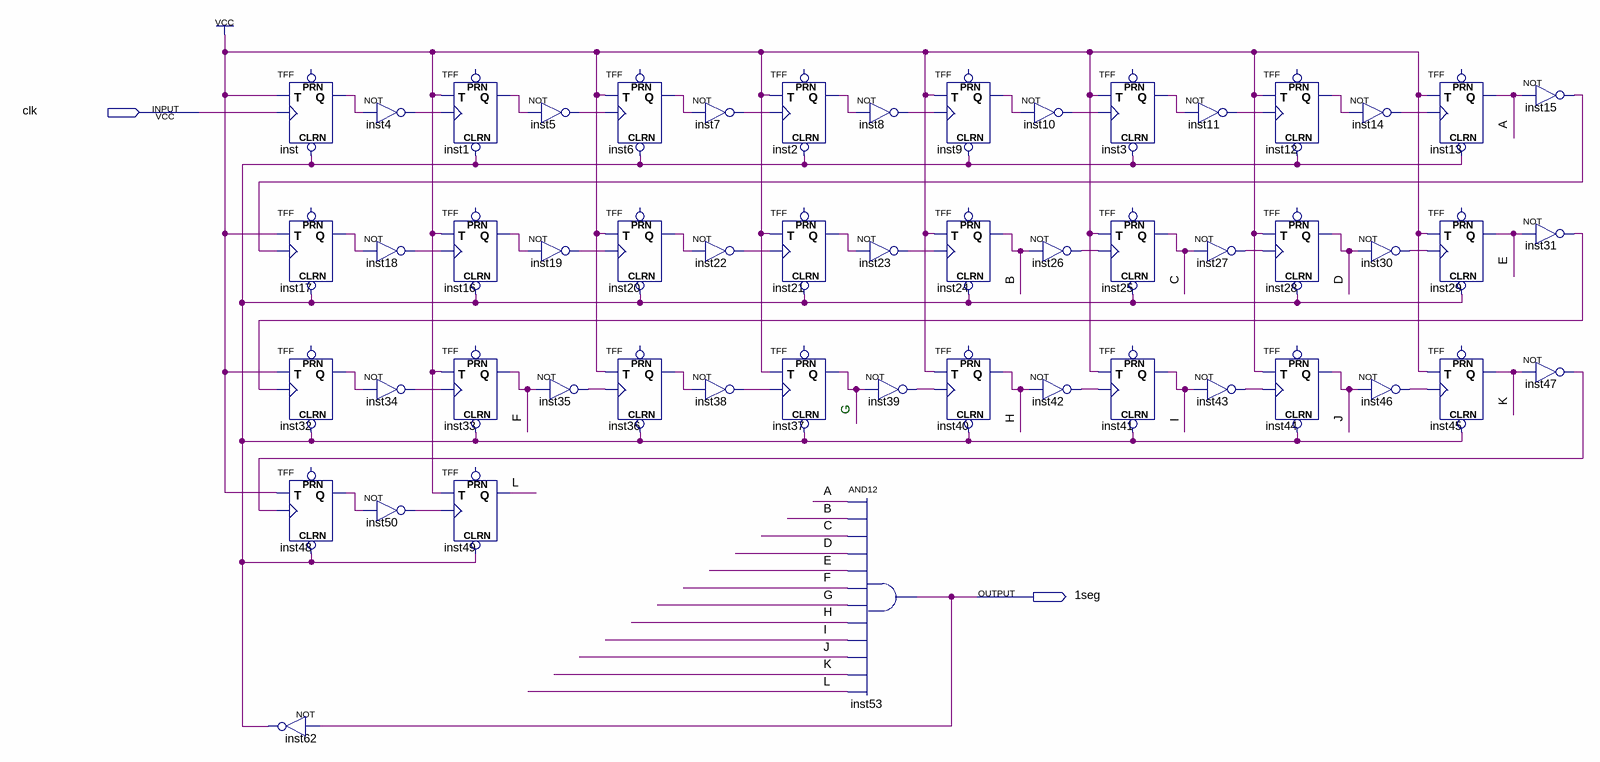
[diagram p0: schematic sheet]
// Quartus schematic Temporizador.bdf as structural Verilog: 53 symbols, 2 pins
module Temporizador (
  input  clk,
  output \1seg 
);

  wire A, B, C, D, E, F, G, H, I, inst1_q, inst2_q, inst3_q, inst4_out, inst5_out, inst6_q, inst7_out,
       inst8_out, inst9_q, inst10_out, inst11_out, inst12_q, inst14_out, inst15_out, inst16_q, inst17_q,
       inst18_out, inst19_out, inst20_q, inst21_q, inst22_out, inst23_out, inst26_out, inst27_out,
       inst30_out, inst31_out, inst32_q, inst34_out, inst35_out, inst36_q, inst38_out, inst39_out,
       inst42_out, inst43_out, inst46_out, inst47_out, inst48_q, inst50_out, inst62_out, inst_q, J, K, L;

  TFF inst (.CLRN(inst62_out), .T(1'b1), .CLK(clk), .Q(inst_q));  // open: PRN
  TFF inst17 (.CLRN(inst62_out), .T(1'b1), .CLK(inst15_out), .Q(inst17_q));  // open: PRN
  TFF inst32 (.CLRN(inst62_out), .T(1'b1), .CLK(inst31_out), .Q(inst32_q));  // open: PRN
  TFF inst48 (.CLRN(inst62_out), .T(1'b1), .CLK(inst47_out), .Q(inst48_q));  // open: PRN
  not inst62 (inst62_out, \1seg );
  not inst4 (inst4_out, inst_q);
  not inst18 (inst18_out, inst17_q);
  not inst34 (inst34_out, inst32_q);
  not inst50 (inst50_out, inst48_q);
  TFF inst1 (.CLRN(inst62_out), .T(1'b1), .CLK(inst4_out), .Q(inst1_q));  // open: PRN
  TFF inst16 (.CLRN(inst62_out), .T(1'b1), .CLK(inst18_out), .Q(inst16_q));  // open: PRN
  TFF inst33 (.CLRN(inst62_out), .T(1'b1), .CLK(inst34_out), .Q(F));  // open: PRN
  TFF inst49 (.CLRN(inst62_out), .T(1'b1), .CLK(inst50_out), .Q(L));  // open: PRN
  not inst5 (inst5_out, inst1_q);
  not inst19 (inst19_out, inst16_q);
  not inst35 (inst35_out, F);
  TFF inst6 (.CLRN(inst62_out), .T(1'b1), .CLK(inst5_out), .Q(inst6_q));  // open: PRN
  TFF inst20 (.CLRN(inst62_out), .T(1'b1), .CLK(inst19_out), .Q(inst20_q));  // open: PRN
  TFF inst36 (.CLRN(inst62_out), .T(1'b1), .CLK(inst35_out), .Q(inst36_q));  // open: PRN
  not inst7 (inst7_out, inst6_q);
  not inst22 (inst22_out, inst20_q);
  not inst38 (inst38_out, inst36_q);
  TFF inst2 (.CLRN(inst62_out), .T(1'b1), .CLK(inst7_out), .Q(inst2_q));  // open: PRN
  TFF inst21 (.CLRN(inst62_out), .T(1'b1), .CLK(inst22_out), .Q(inst21_q));  // open: PRN
  TFF inst37 (.CLRN(inst62_out), .T(1'b1), .CLK(inst38_out), .Q(G));  // open: PRN
  not inst8 (inst8_out, inst2_q);
  not inst23 (inst23_out, inst21_q);
  not inst39 (inst39_out, G);
  and inst53 (\1seg , A, B, C, D, E, F, G, H, I, J, K, L);
  TFF inst9 (.CLRN(inst62_out), .T(1'b1), .CLK(inst8_out), .Q(inst9_q));  // open: PRN
  TFF inst24 (.CLRN(inst62_out), .T(1'b1), .CLK(inst23_out), .Q(B));  // open: PRN
  TFF inst40 (.CLRN(inst62_out), .T(1'b1), .CLK(inst39_out), .Q(H));  // open: PRN
  not inst10 (inst10_out, inst9_q);
  not inst26 (inst26_out, B);
  not inst42 (inst42_out, H);
  TFF inst3 (.CLRN(inst62_out), .T(1'b1), .CLK(inst10_out), .Q(inst3_q));  // open: PRN
  TFF inst25 (.CLRN(inst62_out), .T(1'b1), .CLK(inst26_out), .Q(C));  // open: PRN
  TFF inst41 (.CLRN(inst62_out), .T(1'b1), .CLK(inst42_out), .Q(I));  // open: PRN
  not inst11 (inst11_out, inst3_q);
  not inst27 (inst27_out, C);
  not inst43 (inst43_out, I);
  TFF inst12 (.CLRN(inst62_out), .T(1'b1), .CLK(inst11_out), .Q(inst12_q));  // open: PRN
  TFF inst28 (.CLRN(inst62_out), .T(1'b1), .CLK(inst27_out), .Q(D));  // open: PRN
  TFF inst44 (.CLRN(inst62_out), .T(1'b1), .CLK(inst43_out), .Q(J));  // open: PRN
  not inst14 (inst14_out, inst12_q);
  not inst30 (inst30_out, D);
  not inst46 (inst46_out, J);
  TFF inst13 (.CLRN(inst62_out), .T(1'b1), .CLK(inst14_out), .Q(A));  // open: PRN
  TFF inst29 (.CLRN(inst62_out), .T(1'b1), .CLK(inst30_out), .Q(E));  // open: PRN
  TFF inst45 (.CLRN(inst62_out), .T(1'b1), .CLK(inst46_out), .Q(K));  // open: PRN
  not inst15 (inst15_out, A);
  not inst31 (inst31_out, E);
  not inst47 (inst47_out, K);

  // Notes on the sheet:
  //   G
endmodule
